# Altium schematic sheet PIC ICSP Connector.SchDoc
size 209 x 297 mm; Scale: 1:1; Letter1Column: Э
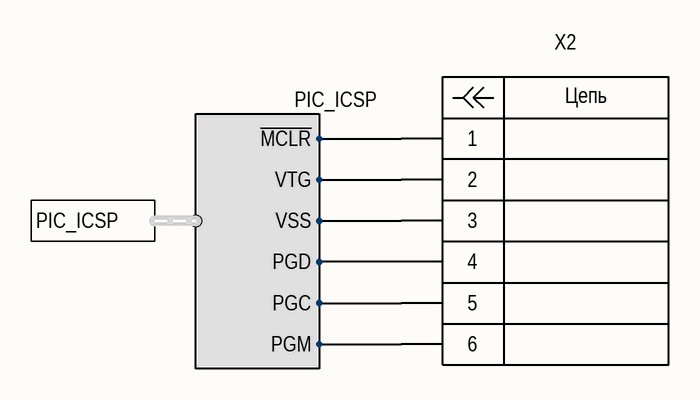
[diagram p0: PIC ICSP Connector.SchDoc]

## Parts
X2  PIC ICSP  [PIC ICSP]  (value not drawn)  (no BOM)

## Ports
PIC_ICSP (harness PIC_ICSP)

## Harnesses
PIC_ICSP: ~{MCLR}, VTG, VSS, PGD, PGC, PGM

## Nets
NetX2_1: X2.1 ; port PIC_ICSP.~{MCLR}
NetX2_2: X2.2 ; port PIC_ICSP.VTG
NetX2_3: X2.3 ; port PIC_ICSP.VSS
NetX2_4: X2.4 ; port PIC_ICSP.PGD
NetX2_5: X2.5 ; port PIC_ICSP.PGC
NetX2_6: X2.6 ; port PIC_ICSP.PGM

## Notes on the sheet
- Перв. примен.
- Справ. №
- Подп. и дата
- Инв. № дубл.
- Взам. инв. №
- Разраб.
- Изм.
- Лист
- № докум.
- Подп.
- Дата
- Лит.
- Масса
- Масштаб
- Пров.
- Т.контр.
- Листов
- Инв. № подл.
- Утв.
- Н.контр.
- 2.106-A4
- Копировал
- Формат А4
- (in symbol PIC ICSP) Цепь

## Library data of the parts
X2 = PIC ICSP: Connector Debug PIC ICSP 3x2P 2.54; Manufacturer: Microchip; Group: Mechanics; Pitch: 2.54mm; Positions: 6; Rows: 1; Dimension: 7.60mm x 5.30mm; Mounting type: Through hole; Package: DIP-6; Part name: PIC ICSP; Height: 0.00mm; Component: Connector debug